# Altium schematic sheet Codec.SchDoc
size A4
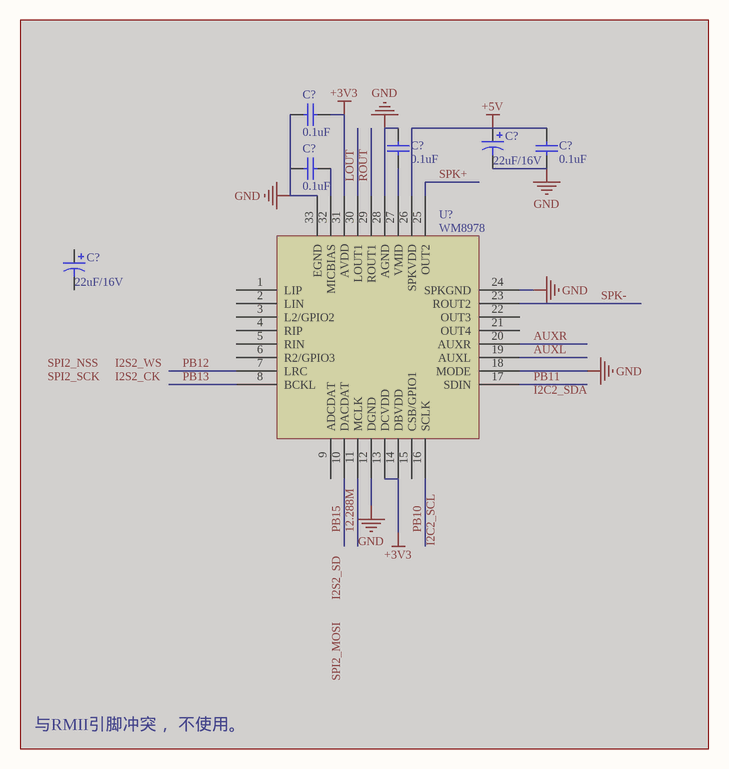
[diagram p0: Codec.SchDoc]

## Parts
(Parts that share a designator on the sheet are numbered #1, #2 ... from top to bottom, then left to right.)
C?#1  0.1uF  [C0805]  (masked out: inside a compile mask, not in the netlist)
C?#2  0.1uF  [C0805]  (masked out: inside a compile mask, not in the netlist)
C?#3  22uF/16V  [C2x3]  (masked out: inside a compile mask, not in the netlist)
C?#4  0.1uF  [C0805]  (masked out: inside a compile mask, not in the netlist)
C?#5  0.1uF  [C0805]  (masked out: inside a compile mask, not in the netlist)
C?#6  22uF/16V  [C2x3]  (masked out: inside a compile mask, not in the netlist)
U?  WM8978  [QFN32]  (masked out: inside a compile mask, not in the netlist)

## Notes on the sheet
- 与RMII引脚冲突， 不使用。

## Library data of the parts
C?#1 C?#2 C?#4 C?#5 = Cap: 0805贴片电容
C?#3 C?#6 = Cap Pol1: 贴片钽电容
U? = WM8978: WM8978 HD Stereo CODEC IC